# EAGLE design main (EAGLE 9.2.0)
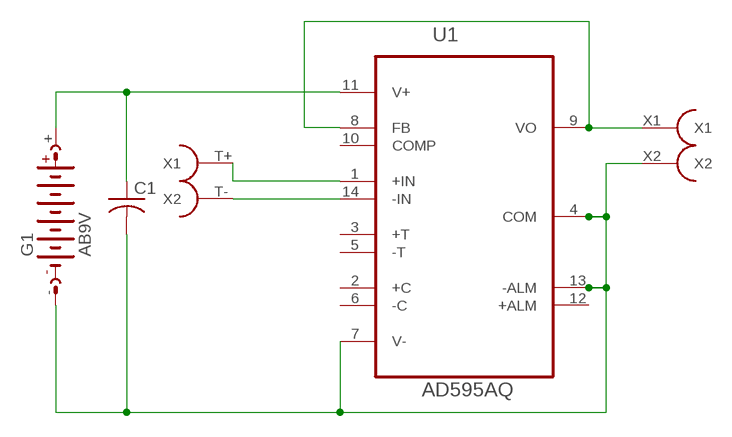
[diagram p0: schematic, sheet 1]

## Parts
C1  C-USC0603  [C0603]
G1  AB9V  [AB9V]
IN  THERMOCOUPLE  [THERMOCOUPLE]
OUT  BANANA_19MM  [BANANA_19MM]
U1  AD595AQ  [DIP254P762X528-14P]

## Nets
GND: C1.2 G1.- OUT.X2 U1.4(COM) U1.7(V-) U1.13(-ALM)
N$1: IN.T-(X2) U1.14(-IN)
N$3: IN.T+(X1) U1.1(+IN)
OUT: OUT.X1 U1.8(FB) U1.9(VO)
VCC: C1.1 G1.+ U1.11(V+)
Unconnected: U1.2(+C) U1.3(+T) U1.5(-T) U1.6(-C) U1.10(COMP) U1.12(+ALM)

## Library data of the parts
C1 = rcl:C-US: CAPACITOR, American symbol; SPICEPREFIX: C
G1 = battery:AB9V: 9-V BATTERY CLIP
IN = 7_segment_lib:THERMOCOUPLE
OUT = 7_segment_lib:BANANA_19MM
U1 = ADI-Phase-2:AD595AQ: Type K Thermocouple Amplifier with Cold Junction Compensation; MPN: AD595AQ; OC_FARNELL: 409194; OC_NEWARK: 06WX1596; PACKAGE: DIP-14; SUPPLIER: Analog Devices

## Board
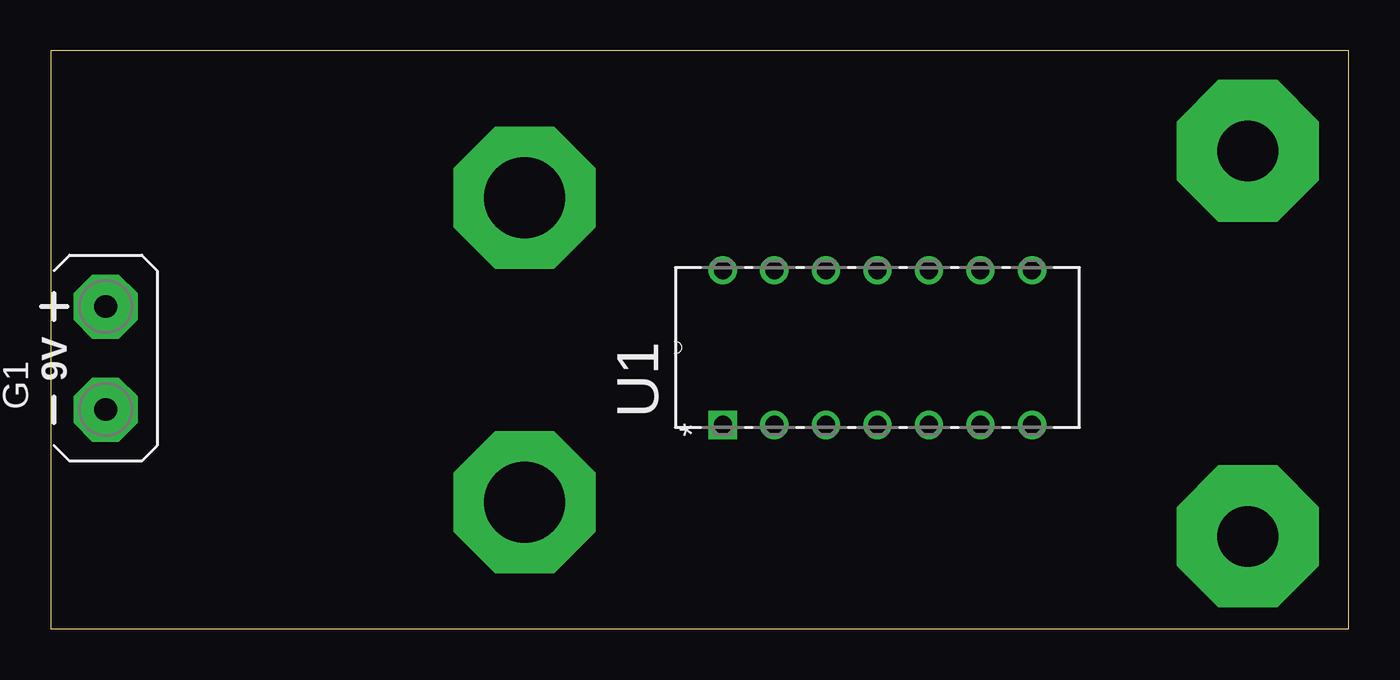
[diagram p1: board, top side]
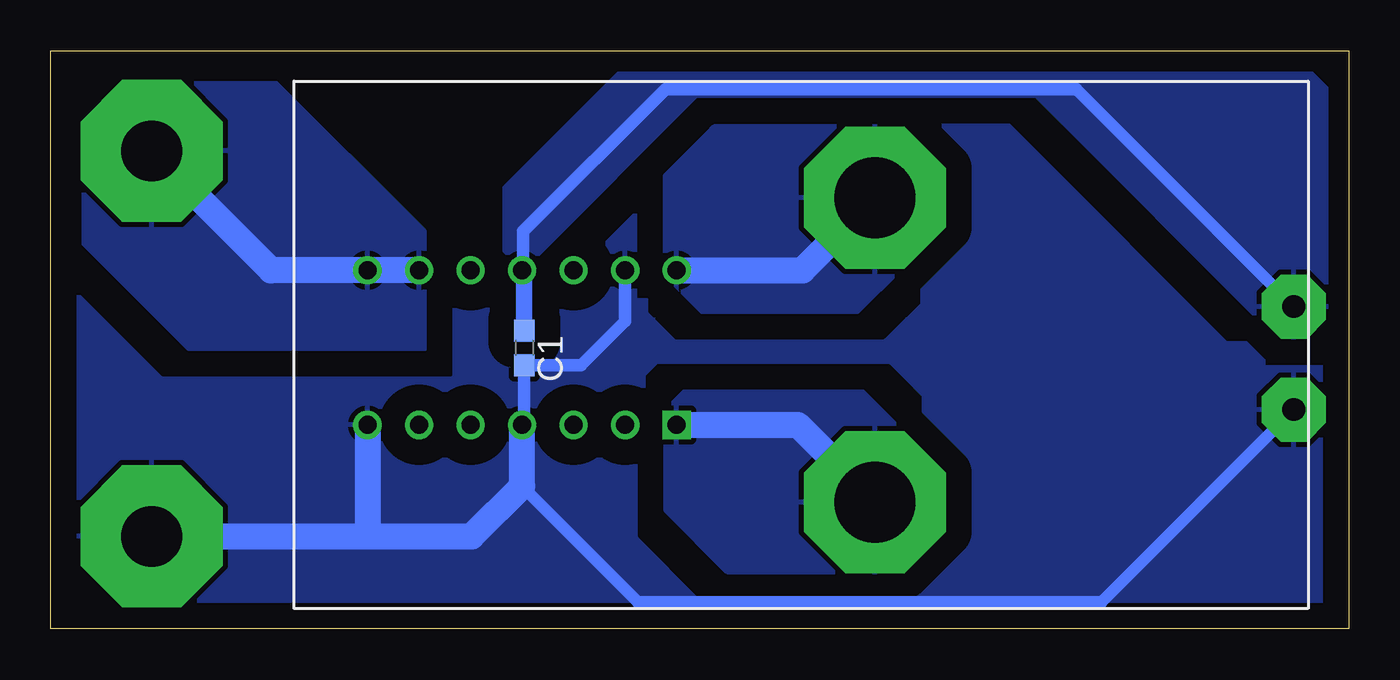
[diagram p2: board, bottom side, seen from below]

Size 64 x 28.5 mm. Coordinates in mm from the lower left corner, seen from the top.
Outline: 0,0 64,0 64,28.5 0,28.5 0,0
Copper layers (1*16): Top 0.035mm / dielectric 1.5mm / Bottom 0.035mm
Design rules "default": minimum track width 6mil, minimum drill 0.35mm, track to track 6mil, track to pad 6mil, pad to pad 6mil, via to via 6mil, smd to smd 6mil, copper to edge 40mil, drill to drill 6mil, minimum pad ring 10mil, minimum via ring 8mil, stop-mask expansion 4mil, vias tented up to drill 0mil, thermal gap 10mil

### Footprints (pad centres in the part's own frame; a part is rotated, then mirrored left to right if it is on the bottom)
C0603 = smd 1.1 x 1: 1 -0.85,0; 2 0.85,0
AB9V = drill 1.118 pad 3.15 octagon: + 0,2.54; - 0,-2.54
THERMOCOUPLE = drill 4 pad 7 octagon: T+ 0,0; T- 15,0
BANANA_19MM = drill 3 pad 7 octagon: X1 0,0; X2 19,0
DIP254P762X528-14P = drill 0.889 square: 1 -7.62,15.24 | drill 0.889: 2 -7.62,12.7; 3 -7.62,10.16; 4 -7.62,7.62; 5 -7.62,5.08; 6 -7.62,2.54; 7 -7.62,0; 8 0,0; 9 0,2.54; 10 0,5.08; 11 0,7.62; 12 0,10.16; 13 0,12.7; 14 0,15.24

### Placement (x,y rotation side)
C1  40.65,13.85 270 bottom
G1  2.71,13.35 0 top
IN  23.36,6.25 90 top
OUT  59.02,23.56 270 top
U1  48.38,17.68 90 top

### Tracks (layer width: path | path; a pad name or v marks a point on that pad's centre or on a via)
GND
  Bottom 0.61: U1.4 40.65,10.17 C1.2 37.85,13 35.68,15.17 U1.13 | G1.- 12.2,1.32 35.03,1.32 40.76,7.05
  Bottom 1.27: OUT.X2 48.33,4.56 | 48.33,4.56 43.25,4.56 40.76,7.05 U1.4 | U1.7 48.38,4.61 48.33,4.56
  pour Bottom (isolate 1.27, rank 5): 0.17,28.43 64.18,28.43 64.18,0.09 0.17,0.09
N$1
  Bottom 1.27: U1.14 26.93,17.68 IN.T-
  pour Bottom (isolate 1.016): 33.7,17.76 33.7,22.34 31.57,24.47 31.26,24.77 22.12,24.77 19.98,22.64 19.98,19.9 22.12,17.76 24.25,15.63 30.96,15.63 31.87,15.63 33.7,17.46
N$3
  Bottom 1.27: U1.1 27.17,10.06 IN.T+
  pour Bottom: 33.7,10.75 33.7,5.88 30.65,2.83 22.12,2.83 19.98,4.96 19.98,7.71 23.95,11.67 29.43,11.67 32.78,11.67
OUT
  Bottom 1.27: U1.9 U1.8 53.14,17.68 OUT.X1
  pour Bottom: 45.59,13.8 57.17,13.8 60.83,17.46 62.35,18.98 62.35,23.25 62.35,25.08 60.52,26.91 52.9,26.91 45.89,19.9 45.59,19.59
VCC
  Bottom 0.61: U1.11 40.65,17.57 40.71,17.63 40.71,19.59 33.7,26.6 13.42,26.6 G1.+
  Bottom 0.813: C1.1 40.65,17.57
  pour Bottom: 0.17,15.33 0.17,25.69 2.61,28.13 35.22,28.13 41.62,21.73 41.62,18.68 41.32,18.37 40.1,18.37 32.18,26.3 21.81,26.3 15.41,26.3 3.52,14.41 1.09,14.41